# Altium schematic sheet SOIC18.SchDoc
size B
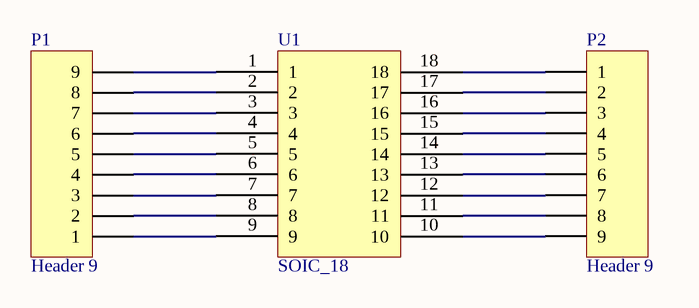
[diagram p0: SOIC18.SchDoc]

## Parts
P1  Header 9  [HDR1X9]
P2  Header 9  [HDR1X9]
U1  SOIC_18  [SOIC18]

## Nets
NetP1_1: P1.1 U1.9
NetP1_2: P1.2 U1.8
NetP1_3: P1.3 U1.7
NetP1_4: P1.4 U1.6
NetP1_5: P1.5 U1.5
NetP1_6: P1.6 U1.4
NetP1_7: P1.7 U1.3
NetP1_8: P1.8 U1.2
NetP1_9: P1.9 U1.1
NetP2_1: P2.1 U1.18
NetP2_2: P2.2 U1.17
NetP2_3: P2.3 U1.16
NetP2_4: P2.4 U1.15
NetP2_5: P2.5 U1.14
NetP2_6: P2.6 U1.13
NetP2_7: P2.7 U1.12
NetP2_8: P2.8 U1.11
NetP2_9: P2.9 U1.10

## Library data of the parts
P1 P2 = Header 9: Header, 9-Pin; LatestRevisionDate: 17-Jul-2002; LatestRevisionNote: Re-released for DXP Platform.; Publisher: Altium Limited